# EAGLE board All-in-one Starter Kit for Pico 2 V1.3 (EAGLE 9.6.2), part 1 of 3
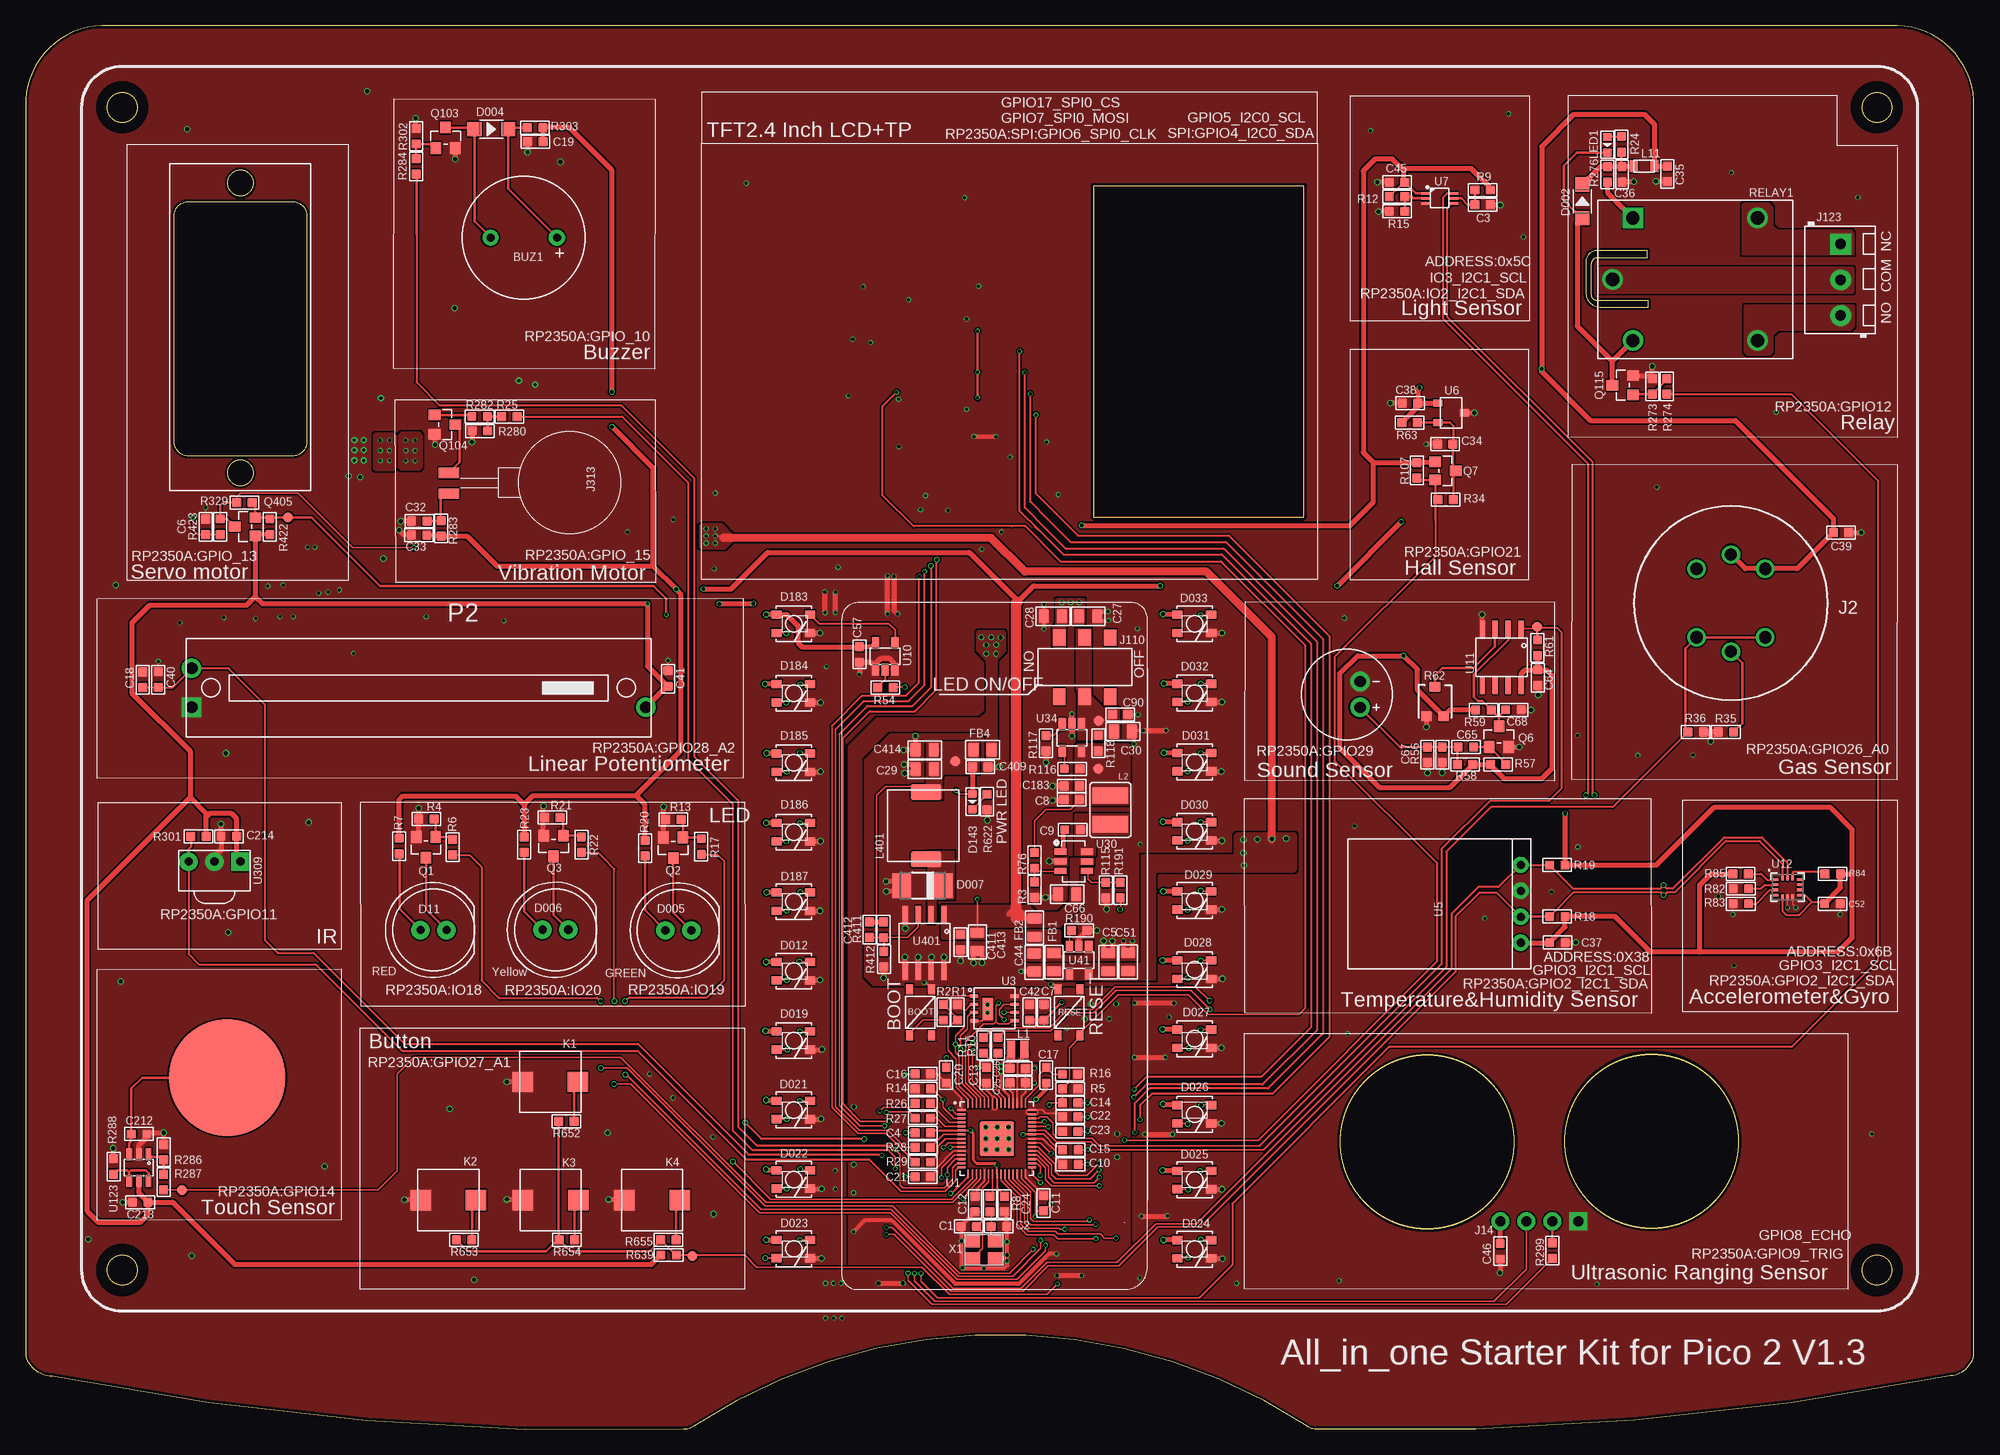
[diagram p5: board, top side]
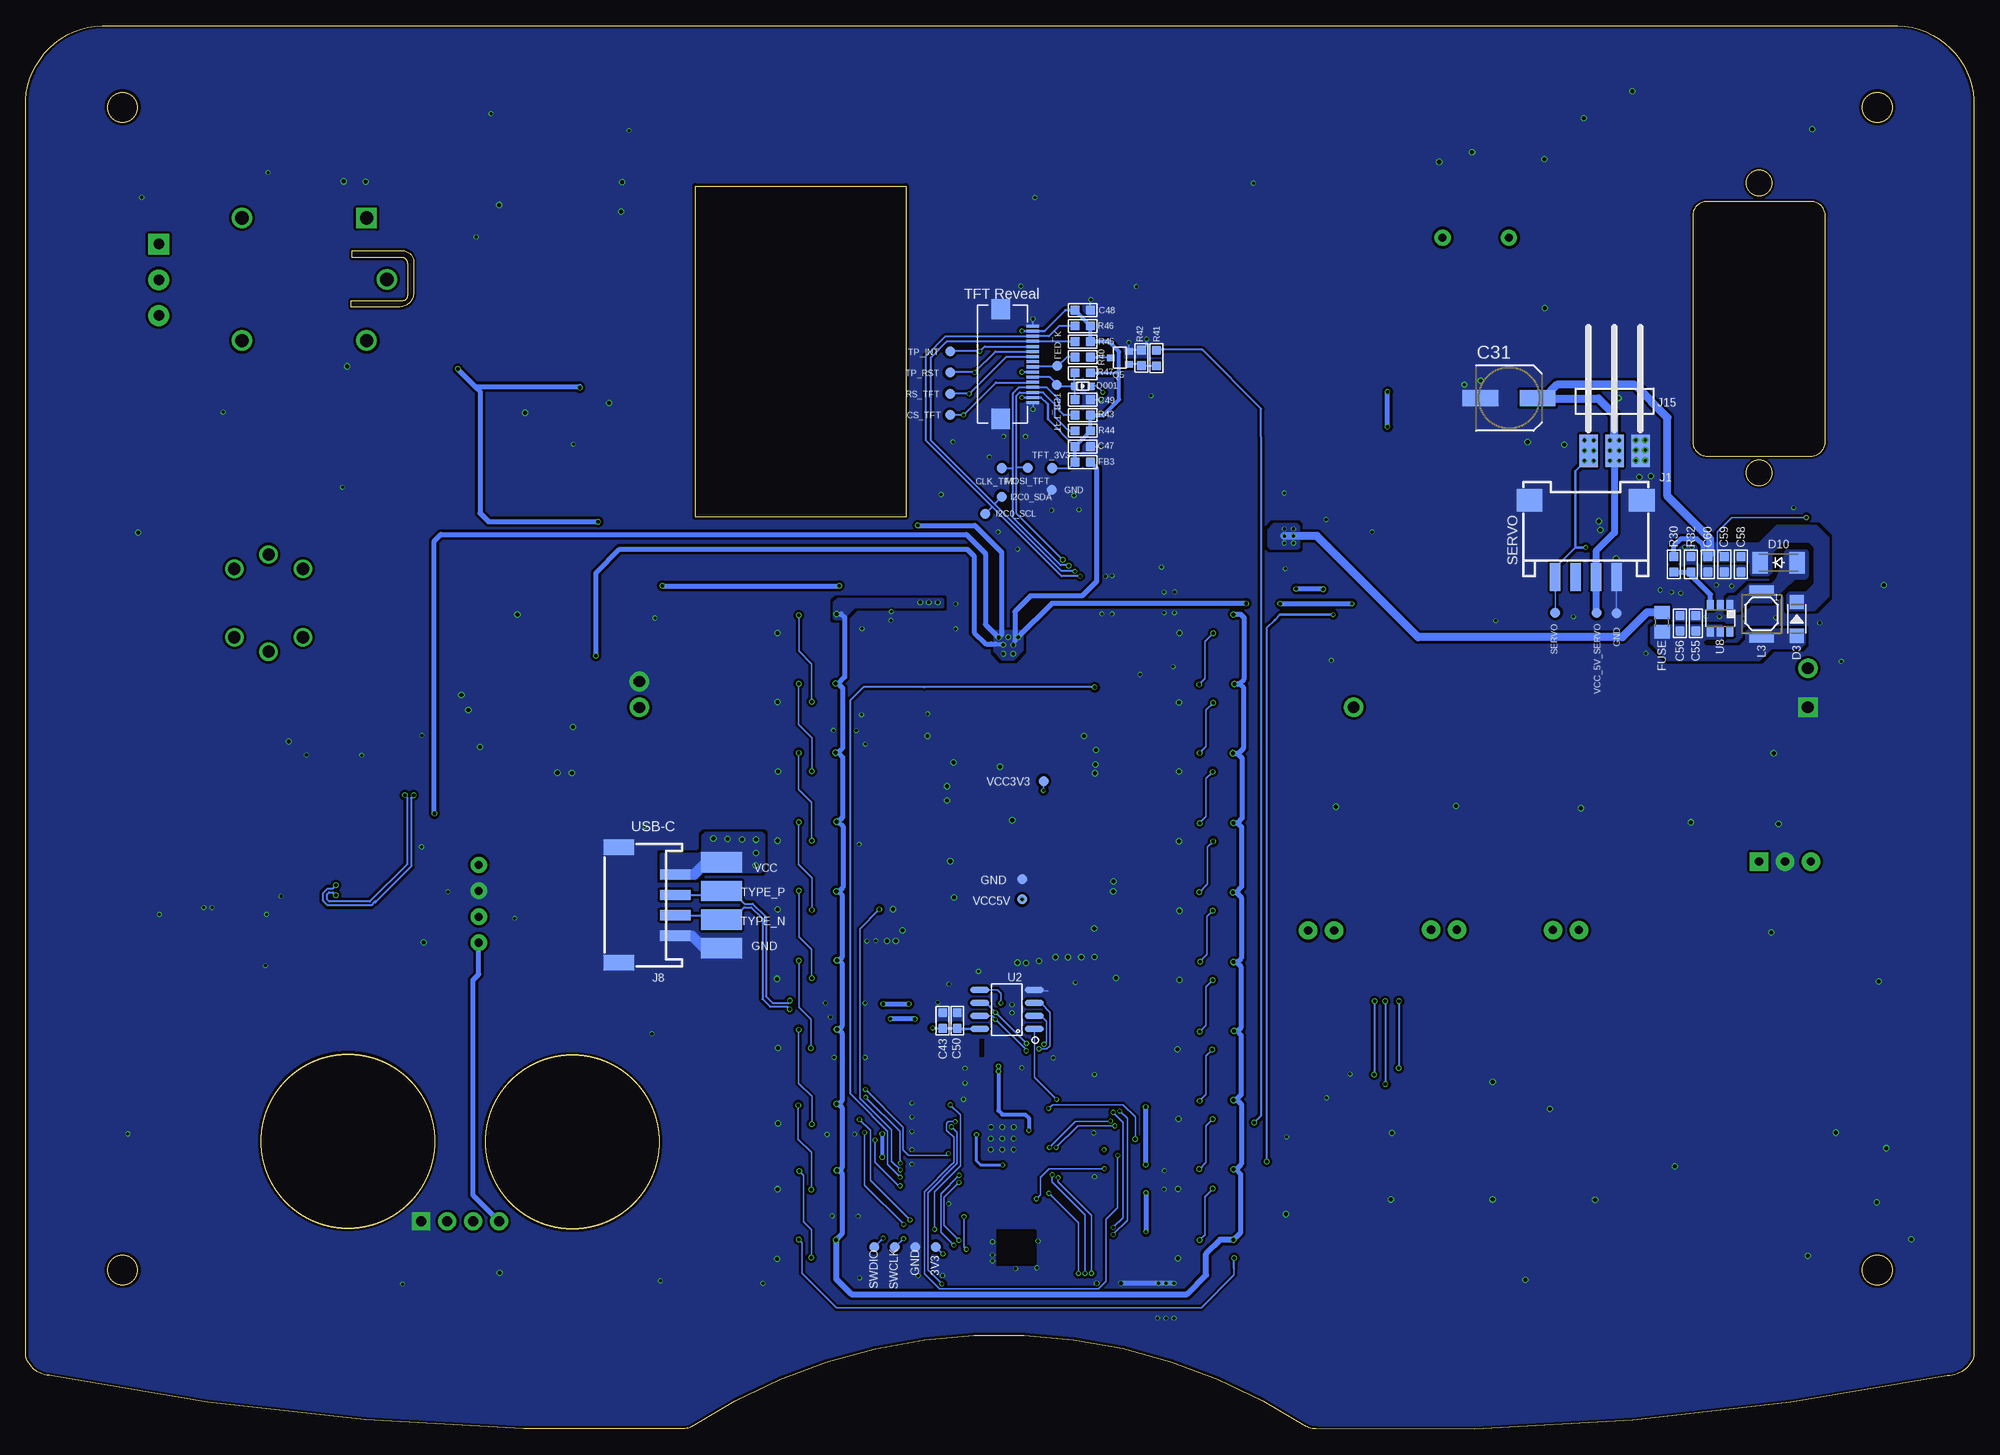
[diagram p6: board, bottom side, seen from below]

Size 190.72 x 137.41 mm. Coordinates in mm from the lower left corner, seen from the top.
Outline: 190.72,7.18 190.72,129.41 arc90 183.22,137.41 7.46,137.41 arc90 0,129.41 0,7.18 arc74 2.63,5.25 arc13 64.41,0.03 arc30 65.4,0.3 arc-66 125.46,0.29 arc30 126.46,0.03 arc13 188.16,5.25 arc74 190.72,7.18
Outline: 27.54,118.78 27.54,96.68 arc-90 26.14,95.28 15.94,95.28 arc-90 14.54,96.68 14.54,118.78 arc-90 15.94,120.18 26.14,120.18 arc-90 27.54,118.78
Outline: 158.75,115.37 154.03,115.37 arc90 152.73,114.41 152.73,111.11 arc90 154.31,109.86 158.83,109.86 158.83,110.5 153.8,110.5 arc-90 153.29,111.01 153.29,114.1 arc-90 153.87,114.69 158.73,114.69 arc90 158.75,114.71 158.75,115.37
Outline: 104.54,89.31 125.15,89.31 125.15,121.7 104.54,121.7 104.54,89.31
Outline: circle at 9.46,15.58 radius 1.45
Outline: circle at 9.46,129.4 radius 1.45
Outline: circle at 181.22,15.58 radius 1.45
Outline: circle at 181.22,129.4 radius 1.45
Outline: circle at 21.04,93.63 radius 1.25
Outline: circle at 21.04,121.99 radius 1.25
Outline: circle at 137.21,28.1 radius 8.5
Outline: circle at 159.16,28.23 radius 8.5
Copper layers (1*16): Top 0.035mm / dielectric 1.5mm / Bottom 0.035mm
Design rules "default *": minimum track width 6mil, minimum drill 0.3mm, track to track 6mil, track to pad 6mil, pad to pad 6mil, via to via 6mil, smd to smd 6mil, copper to edge 10mil, drill to drill 6mil, minimum pad ring 3mil, minimum via ring 3mil, stop-mask expansion 4mil, vias tented up to drill 100mil, thermal gap 0mil
Net classes: 1 PWR: width 0.15 mm, drill 0.25 mm; 2 gnd: width 0.15 mm, drill 0.3 mm, clearance 0.152 mm; 4 USB: width 0.152 mm, clearance 0.152 mm
tRestrict: area 7,13.1 to 12,18.1; area 7,126.9 to 12,131.9; area 178.7,126.9 to 183.7,131.9; area 178.7,13.1 to 183.7,18.1

## Footprints (pad centres in the part's own frame; a part is rotated, then mirrored left to right if it is on the bottom)
SMD_KEY4.2*3.*.2.5 = smd 1 x 0.7: P$1 -2.184,0.102; P$2 2.316,0.102; P$3 -2.184,-2.048; P$4 2.316,-2.048
BUZZER-D12MM-DIP2 = drill 0.8 pad 1.6: 1 -3.25,0; 2 3.25,0
C0603 = smd 0.889 x 0.889: 1 -0.762,0; 2 0.762,0
C0805 = smd 1.016 x 1.397: 1 -0.889,0; 2 0.889,0
SANYO-OSCON_SMD_C6 = smd 3.5 x 1.6: + 2.8,0; - -2.8,0
D_SOD523 = smd 0.762 x 0.7: + -0.8,0; - 0.8,0
D_SOD123 = smd 1.397 x 1.397: + -1.651,0; - 1.651,0
D_SOD123FL = smd 1.397 x 1.397: + -1.651,0; - 1.651,0
LED-8MM = drill 0.8 pad 1.8: 1 -1.27,0; 2 1.27,0
DIODE_DO-214AC = smd 1.8 x 2.4: A 2.025,0; C -2.025,0
SOD-123_MINI-SMA = smd 1.5 x 2.1: A 1.8,0; C -1.8,0
LED_RGB_WS2812_3535 = smd 1 x 0.8: 1 -1.7,0.9; 2 -1.7,-0.9; 3 1.6,-0.9; 4 1.6,0.9
LED_0603_SMT = smd 0.762 x 0.889: 1 -0.762,0; 2 0.762,0
L0805 = smd 1.016 x 1.397: 1 -0.889,0; 2 0.889,0
L0603 = smd 0.889 x 0.889: 1 -0.762,0; 2 0.762,0
FPC-P0.5MM-16P-SMD = smd 0.3 x 1.2: P$1 4.485,0.001; P$2 3.985,0.001; P$3 3.485,0.001; P$4 2.985,0.001; P$5 2.485,0.001; P$6 1.985,0.001; P$7 1.485,0.001; P$8 0.985,0.001; P$9 0.485,0.001; P$10 -0.015,0.001; P$11 -0.515,0.001; P$12 -1.015,0.001; P$13 -1.515,0.001; P$14 -2.015,0.001; P$15 -2.515,0.001; P$16 -3.015,0.001 | smd 2 x 1.8: P$17 6.135,3.151; P$18 -4.611,3.151
R0805 = smd 1.3 x 1.5: 1 -0.95,0; 2 0.95,0
A_XBJ_CONNECTOR_4P-SMD-2.0-90D = smd 1.01 x 2.74: 1 -3,-0.1; 2 -1,-0.1; 3 1,-0.1; 4 3,-0.1 | smd 2.54 x 2.184: SS1 -5.5,7.4; SS2 5.5,7.4
MQ2 = drill 1.2 pad 1.8: 1 0,-6.718; 2 -1.391,-3.359; 3 0,0; 4 6.718,0; 5 8.109,-3.359; 6 6.718,-6.718
TEMPLATE_2P-D8.9MM = drill 1.1 pad 1.93: 1 -1.27,1.27; 2 -1.27,-1.27
TP-SMD-2X4MM = smd 4 x 2: 1 0,0
PH2.0-4P = smd 1 x 3: 1 -3,2.762; 2 -1,2.762; 3 1,2.762; 4 3,2.762 | smd 1.524 x 3: 5 -5.65,-2.763; 6 5.65,-2.763
CROWPI_POW_ULTRA = drill 1 pad 1.778 square: P$1 3.81,0 | drill 1 pad 1.778: P$2 1.27,0; P$3 -1.27,0; P$4 -3.81,0
CON-PZ-2.54MM-1*3P-WT = smd 1.8 x 3.2: 1 -2.54,0; 2 0,0; 3 2.54,0
SWITCH_6PIN_2P = smd 1.2 x 1.6: 1 2.5,-2.9; 2 0,-2.9; 3 -2.5,-2.9; 4 -2.5,2.9; 5 0,2.9; 6 2.5,2.9
3.5MM*3P = drill 1.016 pad 2.032 square: 1 -3.5,0 | drill 1.016 pad 2.032: 2 0,0; 3 3.5,0
MOTOR_1CM = smd 1 x 2: P$1 1.083,-11.822; P$2 -0.956,-11.822
BUTTON_2P = smd 2 x 2: P$1 0.3,0; P$2 5.7,0
SMD,1.6X2MM = smd 0.8 x 1.7: P$1 -0.65,0; P$2 0.65,0
CD32 = smd 3.5 x 1.6: 1 0,1.409; 2 0,-1.409
MS42 = smd 2.4 x 1: 1 0,2.3; 2 0,-2.3
201209 = smd 0.8 x 1.2: 1 -1,0; 2 1,0
L773 = smd 1.5 x 3: 1 -3.29,-0.254; 2 3.29,-0.254
DISCRETE_LED-0603 = smd 0.762 x 0.889: + -0.762,0; - 0.762,0
PAD-1.0MM = smd 1 x 1: P$1 0,0
3P-SQUA-45.6X10X5.8H = drill 1.143 pad 1.905 square: 1 -22.225,-1.905 | drill 1.143 pad 1.905: 2 -22.225,1.905; 3 22.225,-1.905
1P-D450 = smd 11.43 x 11.43: 1 0,0
SOT23@1 = smd 1.016 x 1.143: 1 -0.95,-1.016; 2 0.95,-1.016; 3 0,1.016
MOS_SOT323 = smd 0.635 x 0.762: 1 -0.635,-0.889; 2 0.635,-0.889; 3 0,0.889
SOT23 = smd 1.016 x 1.143: 1 -0.889,-1.016; 2 0.889,-1.016; 3 0,1.016
R0603 = smd 0.889 x 0.889: 1 -0.762,0; 2 0.762,0
3P-SMD-SQUA-3.6X3.3 = smd 1 x 0.9: 1 -0.85,-1.45; 3 0.85,-1.45 | smd 1.1 x 0.9: 2 0,1.45
REY5-6-19.1X15.5X15.3MM = drill 1.3 pad 2 square: 1 -6.1,6 | drill 1.3 pad 2: 2 -8.1,0; 3 -6.1,-6; 4 6.1,6; 5 6.1,-6
QFN-60_7X7MM = smd 0.875 x 0.2: P$1 -3.437,2.8; P$2 -3.437,2.4; P$3 -3.437,2; P$4 -3.437,1.6; P$5 -3.437,1.2; P$6 -3.437,0.8; P$7 -3.437,0.4; P$8 -3.437,0; P$9 -3.437,-0.4; P$10 -3.437,-0.8; P$11 -3.437,-1.2; P$12 -3.437,-1.6; P$13 -3.437,-2; P$14 -3.437,-2.4; P$15 -3.437,-2.8; P$31 3.437,-2.8; P$32 3.437,-2.4; P$33 3.437,-2; P$34 3.437,-1.6; P$35 3.437,-1.2; P$36 3.437,-0.8; P$37 3.437,-0.4; P$38 3.437,0; P$39 3.437,0.4; P$40 3.437,0.8; P$41 3.437,1.2; P$42 3.437,1.6; P$43 3.437,2; P$44 3.437,2.4; P$45 3.437,2.8 | smd 0.2 x 0.875: P$16 -2.8,-3.437; P$17 -2.4,-3.437; P$18 -2,-3.437; P$19 -1.6,-3.437; P$20 -1.2,-3.437; P$21 -0.8,-3.437; P$22 -0.4,-3.437; P$23 0,-3.437; P$24 0.4,-3.437; P$25 0.8,-3.437; P$26 1.2,-3.437; P$27 1.6,-3.437; P$28 2,-3.437; P$29 2.4,-3.437; P$30 2.8,-3.437; P$46 2.8,3.437; P$47 2.4,3.437; P$48 2,3.437; P$49 1.6,3.437; P$50 1.2,3.437; P$51 0.8,3.437; P$52 0.4,3.437; P$53 0,3.437; P$54 -0.4,3.437; P$55 -0.8,3.437; P$56 -1.2,3.437; P$57 -1.6,3.437; P$58 -2,3.437; P$59 -2.4,3.437; P$60 -2.8,3.437 | smd 3.4 x 3.4: P$61 0,0
SOP-8L = smd 0.63 x 1.865: P$1 0,0; P$2 1.27,0; P$3 2.54,0; P$4 3.81,0; P$5 3.81,5.35; P$6 2.54,5.35; P$7 1.27,5.35; P$8 0,5.35
W25QXX-XSON-8-EP(4X4) = smd 0.8 x 0.3: 1 -2,1.2; 2 -2,0.4; 3 -2,-0.4; 4 -2,-1.2; 5 2,-1.2; 6 2,-0.4; 7 2,0.4; 8 2,1.2 | smd 1.067 x 2.184: EP -0.646,-0.051
CROWTAIL-DHT20-V1.0-20211013_DHT20 = drill 0.8 pad 1.6: 1 -3.81,0; 2 -1.27,0; 3 1.27,0; 4 3.81,0
SOT-23W = smd 0.7 x 0.9: 1 -0.95,-1.3; 2 0.95,-1.3; 3 0,1.3
BH1750-WSOF-6 = smd 0.8 x 0.27: 1 -1.4,0.5; 2 -1.4,0; 3 -1.4,-0.5; 4 1.4,-0.5; 5 1.4,0; 6 1.4,0.5
DBV_R-PDSO-G6 = smd 0.69 x 0.99: 1 -0.95,-1.29; 2 0,-1.29; 3 0.95,-1.29; 4 0.95,1.3; 5 0,1.3; 6 -0.95,1.3
SOT23-5 = smd 0.69 x 1.2: 1 -0.95,-1.3; 2 0,-1.3; 3 0.95,-1.3; 4 0.95,1.3; 5 -0.95,1.3
SOP8@1 = smd 0.5 x 1.6: 1 -1.905,-2.8; 2 -0.635,-2.8; 3 0.635,-2.8; 4 1.905,-2.8; 5 1.905,2.8; 6 0.635,2.8; 7 -0.635,2.8; 8 -1.905,2.8
LGA-14L = smd 0.475 x 0.25: 1 -1.163,0.75; 2 -1.163,0.25; 3 -1.163,-0.25; 4 -1.163,-0.75; 8 1.163,-0.75; 9 1.163,-0.25; 10 1.163,0.25; 11 1.163,0.75 | smd 0.25 x 0.475: 5 -0.5,-0.912; 6 0,-0.912; 7 0.5,-0.912; 12 0.5,0.912; 13 0,0.912; 14 -0.5,0.912
MT2492-SOT23-6 = smd 0.6 x 1.2: 1 -0.95,-1.3; 2 0,-1.3; 3 0.95,-1.3; 4 0.95,1.3; 5 0,1.3; 6 -0.95,1.3
IC_SOT23-5 = smd 0.69 x 1.2: 1 -0.95,-1.3; 2 0,-1.3; 3 0.95,-1.3; 4 0.95,1.3; 5 -0.95,1.3
SOT23-6L = smd 0.55 x 1.2: 1 -0.95,-1.3; 2 0,-1.3; 3 0.95,-1.3; 4 0.95,1.3; 5 0,1.3; 6 -0.95,1.3
VS1838B-SIP3 = drill 0.8 pad 1.8 square: 1 -2.54,0 | drill 0.8 pad 1.8: 2 0,0; 3 2.54,0
TD1509 = smd 0.5 x 1.6: P$1 -1.905,-2.8; P$2 -0.635,-2.8; P$3 0.635,-2.8; P$4 1.905,-2.8; P$5 1.905,2.8; P$6 0.635,2.8; P$7 -0.635,2.8; P$8 -1.905,2.8
A_XBJ_SMD3225 = smd 1.4 x 1.2: 1 -1.1,-0.85; 2 1.1,-0.85; 3 1.1,0.85; 4 -1.1,0.85

## Placement (x,y rotation side)
BOOT  TS3425BA  [SMD_KEY4.2*3.*.2.5]  86.63,40.75 90 top
BUZ1  BUZZER_1295  [BUZZER-D12MM-DIP2]  48.77,116.64 180 top
C1  15pF/16V  [C0603]  92.33,19.84 0 top
C2  15pF/16V  [C0603]  95.28,19.84 0 top
C3  100nF  [C0603]  142.62,119.86 180 top
C4  4.7uF/16V  [C0603]  87.82,29.03 180 top
C5  104  [C0805]  105.97,45.73 270 top
C6  100nF  [C0603]  17.64,88.35 270 top
C7  100nF/16V  [C0603]  99.7,40.81 90 top
C8  4.7uF  [C0603]  102.41,61.65 180 top
C9  22nF  [C0603]  102.49,58.69 180 top
C10  100nF/16V  [C0603]  102.28,25.94 0 top
C11  100nF/16V  [C0603]  99.65,22.13 270 top
C12  100nF/16V  [C0603]  92.94,22.03 270 top
C13  100nF/16V  [C0603]  94.05,34.65 90 top
C14  100nF/16V  [C0603]  102.25,31.94 180 top
C15  100nF/16V  [C0603]  102.28,27.36 0 top
C16  100nF/16V  [C0603]  87.82,34.78 180 top
C17  4.7uF/16V  [C0603]  99.91,34.65 270 top
C18  100nF  [C0603]  11.48,73.36 270 top
C19  100nF  [C0603]  49.9,126.03 180 top
C20  100nF/16V  [C0603]  90.12,34.65 90 top
C21  100nF/16V  [C0603]  87.82,24.72 180 top
C22  100nF/16V  [C0603]  102.25,30.56 0 top
C23  100nF/16V  [C0603]  102.25,29.14 0 top
C24  100nF/16V  [C0603]  95.81,22.03 270 top
C25  4.7uF/16V  [C0603]  97.12,33.89 180 top
C26  4.7uF/16V  [C0603]  97.12,35.31 180 top
C27  22uF  [C0805]  104.01,79.59 0 top
C28  22uF  [C0805]  100.56,79.59 180 top
C29  10UF  [C0805]  88.03,64.6 180 top
C30  22uF  [C0805]  107.42,68.31 0 top
C31  100UF  [SANYO-OSCON_SMD_C6]  45.51,100.95 0 bottom
C32  100nF  [C0603]  38.54,88.89 0 top
C33  100nF  [C0603]  38.52,87.52 0 top
C34  1uF  [C0603]  138.96,96.43 0 top
C35  100nF  [C0603]  160.69,122.89 90 top
C36  100nF  [C0603]  156.27,122.84 90 top
C37  100nF  [C0603]  149.94,47.63 180 top
C38  100nF  [C0603]  135.51,100.44 0 top
C39  100nF  [C0603]  177.71,87.78 180 top
C40  22uF  [C0603]  12.98,73.39 270 top
C41  100nF  [C0603]  62.9,73.48 270 top
C42  2.2uF/16V  [C0603]  98.27,40.81 90 top
C43  2.2uF/16V  [C0603]  100.94,40.01 270 bottom
C44  22uF  [C0805]  98.73,45.7 270 top
C45  1uF  [C0603]  134.24,122.06 0 top
C46  100nF  [C0603]  144.34,17.42 270 top
C47  100nF/0603  [C0603]  87.22,96.21 180 bottom
C48  100nF/0603  [C0603]  87.22,109.54 180 bottom
C49  1uF  [C0603]  87.22,100.81 180 bottom
C50  100nF/16V  [C0603]  99.52,40.01 270 bottom
C51  22uF  [C0805]  107.93,45.75 90 top
C52  100nF  [C0603]  176.86,51.44 180 top
C55  22UF/16V  [C0603]  27.22,78.9 270 bottom
C56  100NF  [C0603]  28.77,78.89 270 bottom
C57  100nF  [C0603]  81.61,75.85 270 top
C58  22UF/16V  [C0603]  22.8,84.67 90 bottom
C59  22UF/16V  [C0603]  24.45,84.67 90 bottom
C60  100NF  [C0603]  26.05,84.67 90 bottom
C64  100nF  [C0603]  148.03,73.58 90 top
C65  100nF  [C0603]  140.99,66.78 180 top
C66  22uF  [C0805]  101.95,52.38 180 top
C67  27pF  [C0603]  137.22,66.02 90 top
C68  100nF  [C0603]  145.64,70.43 180 top
C90  4.7uF  [C0603]  107.15,69.95 0 top
C183  4.7uF  [C0603]  102.41,62.96 180 top
C212  12pF(1-50P)  [C0603]  11.12,28.89 180 top
C213  4.7uF  [C0603]  11.23,22.23 0 top
C214  4.7uF  [C0603]  19.9,58.04 0 top
C409  100nF  [C0603]  93.45,64.84 180 top
C411  100nF  [C0603]  91.53,47.7 90 top
C412  10nF  [C0603]  82.61,48.9 90 top
C413  22uF  [C0805]  93.17,47.71 270 top
C414  22uF  [C0805]  88.01,66.51 180 top
D001  B5819WT  [D_SOD523]  87.22,102.1 0 bottom
D002  1N4148  [D_SOD123]  152.39,120.2 90 top
D3  NC  [D_SOD123FL]  17.34,79.32 90 bottom
D004  1N4148  [D_SOD123]  45.58,127.26 0 top
D005  GREEN  [LED-8MM]  63.89,48.83 0 top
D006  Yellow  [LED-8MM]  51.87,48.9 0 top
D007  SS54/SMA  [DIODE_DO-214AC]  87.81,53.22 180 top
D10  B5819W  [SOD-123_MINI-SMA]  19.13,84.83 0 bottom
D11  RED  [LED-8MM]  39.93,48.87 0 top
D012  WS2812B  [LED_RGB_WS2812_3535]  75.2,44.85 0 top
D019  WS2812B  [LED_RGB_WS2812_3535]  75.2,38.05 0 top
D021  WS2812B  [LED_RGB_WS2812_3535]  75.2,31.25 0 top
D022  WS2812B  [LED_RGB_WS2812_3535]  75.2,24.45 0 top
D023  WS2812B  [LED_RGB_WS2812_3535]  75.2,17.65 0 top
D024  WS2812B  [LED_RGB_WS2812_3535]  114.45,17.62 0 top
D025  WS2812B  [LED_RGB_WS2812_3535]  114.45,24.41 0 top
D026  WS2812B  [LED_RGB_WS2812_3535]  114.45,30.83 0 top
D027  WS2812B  [LED_RGB_WS2812_3535]  114.45,38.22 0 top
D028  WS2812B  [LED_RGB_WS2812_3535]  114.45,44.98 0 top
D029  WS2812B  [LED_RGB_WS2812_3535]  114.45,51.76 0 top
D030  WS2812B  [LED_RGB_WS2812_3535]  114.45,58.53 0 top
D031  WS2812B  [LED_RGB_WS2812_3535]  114.45,65.31 0 top
D032  WS2812B  [LED_RGB_WS2812_3535]  114.45,72.08 0 top
D033  WS2812B  [LED_RGB_WS2812_3535]  114.45,78.86 0 top
D143  NC/Green  [LED_0603_SMT]  92.67,61.44 270 top
D183  WS2812B  [LED_RGB_WS2812_3535]  75.2,78.86 0 top
D184  WS2812B  [LED_RGB_WS2812_3535]  75.2,72.05 0 top
D185  WS2812B  [LED_RGB_WS2812_3535]  75.2,65.25 0 top
D186  WS2812B  [LED_RGB_WS2812_3535]  75.2,58.45 0 top
D187  WS2812B  [LED_RGB_WS2812_3535]  75.2,51.65 0 top
FB1  NC  [L0805]  100.66,45.73 90 top
FB2  R_120/100MHZ_3A  [L0805]  98.76,49.11 90 top
FB3  R_600/100MHZ_0.5A  [L0603]  87.22,94.67 180 bottom
FB4  R_120/100MHZ_3A  [L0805]  93.67,66.51 0 top
FPC1  P024C128-CTPFPC-P0.5MM-16P-SMD  [FPC-P0.5MM-16P-SMD]  92.13,103.51 90 bottom
FUSE  500MA  [R0805]  30.53,79.01 270 bottom
J1  [A_XBJ_CONNECTOR_4P-SMD-2.0-90D]  37.99,83.52 0 bottom
J2  [MQ2]  170.28,84.23 270 top
J3  SOUND  [TEMPLATE_2P-D8.9MM]  129.36,71.93 180 top
J4  TP-SMDTP-SMD-2X4MM  [TP-SMD-2X4MM]  122.58,55.51 0 bottom
J5  TP-SMDTP-SMD-2X4MM  [TP-SMD-2X4MM]  122.58,49.88 0 bottom
J6  TP-SMDTP-SMD-2X4MM  [TP-SMD-2X4MM]  122.58,52.7 0 bottom
J7  TP-SMDTP-SMD-2X4MM  [TP-SMD-2X4MM]  122.58,47.07 0 bottom
J8  PH2.0-4P-WOTIE  [PH2.0-4P]  129.87,51.32 270 bottom
J14  CROWPI_POW_ULTRA  [CROWPI_POW_ULTRA]  148.17,20.36 0 top
J15  CON-2.54MM-3P  [CON-PZ-2.54MM-1*3P-WT]  35.18,95.79 0 bottom
J110  switch_6pin  [SWITCH_6PIN_2P]  103.68,74.61 180 top
J123  3.5MM3P  [3.5MM*3P]  177.67,112.52 270 top
J313  MOTOR_1CN  [MOTOR_1CM]  53.25,92.67 270 top
K1  BUTTON_2P  [BUTTON_2P]  48.36,34 0 top
K2  BUTTON_2P  [BUTTON_2P]  38.39,22.44 0 top
K3  BUTTON_2P  [BUTTON_2P]  48.4,22.44 0 top
K4  BUTTON_2P  [BUTTON_2P]  58.33,22.44 0 top
L1  3.3uH  [SMD,1.6X2MM]  97.12,37.15 0 top
L2  CD32_950MA  [CD32]  106.18,60.63 180 top
L3  10UH  [MS42]  20.78,79.81 180 bottom
L11  0R  [201209]  158.43,123.63 180 top
L401  33UH  [L773]  87.88,59.09 90 top
LED1  RED  [DISCRETE_LED-0603]  154.83,125.74 270 top
P1  PADPAD-1.0MM  [PAD-1.0MM]  91.01,65.41 0 top
P2  [3P-SQUA-45.6X10X5.8H]  38.48,72.58 0 top
P3  PADPAD-1.0MM  [PAD-1.0MM]  101.63,17.84 90 bottom
P4  PADPAD-1.0MM  [PAD-1.0MM]  103.63,17.84 90 bottom
P5  PADPAD-1.0MM  [PAD-1.0MM]  105.63,17.84 90 bottom
P6  PADPAD-1.0MM  [PAD-1.0MM]  107.63,17.84 90 bottom
P7  PADPAD-1.0MM  [PAD-1.0MM]  93.17,51.87 0 bottom
P8  PADPAD-1.0MM  [PAD-1.0MM]  91.06,63.46 0 bottom
P9  PADPAD-1.0MM  [PAD-1.0MM]  93.14,53.86 0 bottom
P10  PADPAD-1.0MM  [PAD-1.0MM]  36.93,79.92 0 bottom
P11  PADPAD-1.0MM  [PAD-1.0MM]  35,79.86 0 bottom
P12  PADPAD-1.0MM  [PAD-1.0MM]  41,79.94 0 bottom
P13  PADPAD-1.0MM  [PAD-1.0MM]  89.76,102.22 0 bottom
P14  PADPAD-1.0MM  [PAD-1.0MM]  89.74,104.07 0 bottom
P15  PADPAD-1.0MM  [PAD-1.0MM]  96.77,89.62 0 bottom
P16  PADPAD-1.0MM  [PAD-1.0MM]  95.17,91.29 0 bottom
P17  PADPAD-1.0MM  [PAD-1.0MM]  100.2,105.52 0 bottom
P18  PADPAD-1.0MM  [PAD-1.0MM]  100.2,103.44 0 bottom
P19  PADPAD-1.0MM  [PAD-1.0MM]  100.2,101.37 0 bottom
P20  PADPAD-1.0MM  [PAD-1.0MM]  100.2,99.3 0 bottom
P21  PADPAD-1.0MM  [PAD-1.0MM]  95.15,94.09 0 bottom
P22  PADPAD-1.0MM  [PAD-1.0MM]  92.63,94.11 0 bottom
P23  PADPAD-1.0MM  [PAD-1.0MM]  90.22,94.09 0 bottom
P24  PADPAD-1.0MM  [PAD-1.0MM]  90.25,91.96 0 bottom
P30  PADPAD-1.0MM  [PAD-1.0MM]  147.97,78.55 0 top
P53  PADPAD-1.0MM  [PAD-1.0MM]  25.69,89.27 270 top
P55  PADPAD-1.0MM  [PAD-1.0MM]  15.31,23.4 180 top
P61  PADPAD-1.0MM  [PAD-1.0MM]  65.27,16.97 90 top
P69  PADPAD-1.0MM  [PAD-1.0MM]  105.01,64.67 0 top
P70  PADPAD-1.0MM  [PAD-1.0MM]  105.03,69.36 0 top
P101  KEY  [1P-D450]  19.73,34.42 90 top
Q1  S9013  [SOT23@1]  39.19,56.97 180 top
Q2  S9013  [SOT23@1]  63.39,56.91 180 top
Q3  S9013  [SOT23@1]  51.68,57.09 180 top
Q5  SS8050W-SOT323  [MOS_SOT323]  83.6,104.9 90 bottom
Q6  S9013  [SOT23@1]  144.23,67.81 0 top
Q7  BSS138  [SOT23]  138.99,93.82 270 top
Q103  S9013  [SOT23@1]  41.11,126.41 0 top
Q104  S9013  [SOT23@1]  41.06,98.35 270 top
Q115  S9013  [SOT23@1]  156.34,102.19 90 top
Q405  2N7002  [SOT23]  21.49,88.36 90 top
R1  10K  [R0603]  91.21,40.81 90 top
R2  1K  [R0603]  89.84,40.81 270 top
R3  4.7K 1%  [R0603]  98.75,52.82 90 top
R4  10K  [R0603]  39.23,59.75 0 top
R5  10k  [R0603]  102.25,33.33 0 top
R6  1K  [R0603]  41.82,56.97 270 top
R7  470R  [R0603]  36.56,57.09 270 top
R8  1k  [R0603]  94.4,22.03 270 top
R9  10K  [R0603]  142.63,121.31 180 top
R10  27.4R  [R0603]  95.2,37.57 270 top
R11  27.4R  [R0603]  93.78,37.57 270 top
R12  10K  [R0603]  134.24,120.64 180 top
R13  10K  [R0603]  63.41,59.7 0 top
R14  10K  [R0603]  87.82,33.33 180 top
R15  NC  [R0603]  134.24,119.22 0 top
R16  33R  [R0603]  102.23,34.75 180 top
R17  1K  [R0603]  66.14,57.04 270 top
R18  4.7K  [R0603]  149.93,50.18 180 top
R19  4.7K  [R0603]  149.93,55.22 180 top
R20  100R  [R0603]  60.63,56.89 270 top
R21  10K  [R0603]  51.58,59.88 0 top
R22  1K  [R0603]  54.41,57.22 270 top
R23  470R  [R0603]  48.82,57.22 270 top
R24  4.7K  [R0603]  156.22,125.78 270 top
R25  0R  [R0603]  47.36,99.13 0 top
R26  0R  [R0603]  87.82,31.9 180 top
R27  0R  [R0603]  87.82,30.46 180 top
R28  0R  [R0603]  87.82,27.59 180 top
R29  0R  [R0603]  87.82,26.16 180 top
R30  95.3K  [R0603]  29.37,84.67 270 bottom
R32  13K  [R0603]  27.69,84.67 90 bottom
R34  NC  [R0603]  138.99,91.02 0 top
R35  5.1R  [R0603]  166.43,68.25 0 top
R36  4.7K  [R0603]  163.48,68.26 0 top
R40  10R  [R0603]  87.22,104.94 180 bottom
R41  1K  [R0603]  80.01,104.85 90 bottom
R42  47K  [R0603]  81.47,104.89 90 bottom
R43  4.7k  [R0603]  87.22,99.27 0 bottom
R44  4.7k  [R0603]  87.22,97.74 0 bottom
R45  4.7k  [R0603]  87.22,106.47 0 bottom
R46  4.7k  [R0603]  87.22,108 0 bottom
R47  10k  [R0603]  87.22,103.4 0 bottom
R54  0R  [R0603]  84.17,72.62 180 top
R56  51K  [R0603]  138.66,66.02 270 top
R57  510K  [R0603]  144.14,65.08 180 top
R58  10K  [R0603]  140.9,65.09 0 top
R59  1K  [R0603]  142.71,70.42 180 top
R61  1K  [R0603]  148,76.51 270 top
R62  10K  [3P-SMD-SQUA-3.6X3.3]  137.96,71.24 0 top
R63  10K  [R0603]  135.48,98.53 180 top
R76  30.9K 1%  [R0603]  98.75,55.68 90 top
R82  0R  [R0603]  167.89,52.92 0 top
R83  0R  [R0603]  167.89,51.44 0 top
R84  4.7K  [R0603]  176.89,54.36 180 top
R85  4.7K  [R0603]  167.87,54.36 0 top
R107  10K  [R0603]  136.19,93.87 90 top
R115  10K  [R0603]  105.73,52.77 270 top
R116  10K  [R0603]  102.44,64.66 0 top
R117  14k  [R0603]  99.88,67.15 270 top
R118  NC  [R0603]  105,67.17 90 top
R190  3.3k  [R0603]  103.15,48.82 0 top
R191  10K  [R0603]  107.16,52.78 90 top
R273  10K  [R0603]  159.25,102.1 270 top
R274  1K  [R0603]  160.65,102.09 270 top
R276  22R  [R0603]  154.85,122.84 270 top
R280  10K  [R0603]  44.48,97.73 0 top
R282  2K  [R0603]  44.45,99.15 180 top
R283  22R  [R0603]  40.67,88.19 90 top
R284  2K  [R0603]  38.24,123.61 90 top
R286  10K  [R0603]  13.52,27.12 90 top
R287  1K  [R0603]  13.5,24.19 270 top
R288  10K  [R0603]  8.61,25.72 90 top
R299  2K  [R0603]  149.46,17.5 270 top
R301  10K  [R0603]  16.93,58.04 180 top
R302  10K  [R0603]  38.22,126.58 270 top
R303  22R  [R0603]  49.87,127.42 180 top
R329  NC  [R0603]  21.43,90.72 0 top
R411  30K/1%  [R0603]  83.99,48.89 90 top
R412  18K/1%  [R0603]  84.01,46.01 90 top
R422  4.7k  [R0603]  23.92,88.36 270 top
R423  4.7K  [R0603]  19.05,88.35 90 top
R622  200K  [R0603]  94.12,61.41 270 top
R639  1K  [R0603]  62.94,17.05 0 top
R652  2.7K  [R0603]  52.93,30.13 180 top
R653  3.74K  [R0603]  42.93,18.53 180 top
R654  5.6K  [R0603]  52.98,18.53 180 top
R655  8.2K  [R0603]  62.93,18.53 180 top
RELAY1  [REY5-6-19.1X15.5X15.3MM]  163.43,112.57 0 top
RESET  TS3425BA  [SMD_KEY4.2*3.*.2.5]  103.12,40.88 270 top
U1  RP2350A  [QFN-60_7X7MM]  95.07,28.44 0 top
U2  [SOP-8L]  91.97,39.17 90 bottom
U3  W25Q64JVXGIQ  [W25QXX-XSON-8-EP(4X4)]  94.83,41.2 0 top
U5  DHT20  [CROWTAIL-DHT20-V1.0-20211013_DHT20]  146.35,51.43 90 top
U6  HAL248  [SOT-23W]  139.53,99.5 270 top
U7  [BH1750-WSOF-6]  138.43,120.49 0 top
U8  MT3608  [DBV_R-PDSO-G6]  24.84,79.4 180 bottom
U10  SN74LVC1G125  [SOT23-5]  84.14,75.66 0 top
U11  LM393  [SOP8@1]  144.49,75.57 180 top
U12  LSM6DS3TR-C  [LGA-14L]  172.47,53.04 0 top
U30  MT2492  [MT2492-SOT23-6]  102.6,55.59 270 top
U34  LPW5206AB5F  [IC_SOT23-5]  102.42,67.71 180 top
U41  PW1503  [SOT23-5]  103.12,45.91 180 top
U123  TTP223  [SOT23-6L]  11.1,25.62 180 top
U309  IR-3PSIP3  [VS1838B-SIP3]  18.5,55.57 180 top
U401  TD1509  [TD1509]  88.01,47.61 180 top
X1  X322512MSB4SI  [A_XBJ_SMD3225]  93.81,17.57 0 top